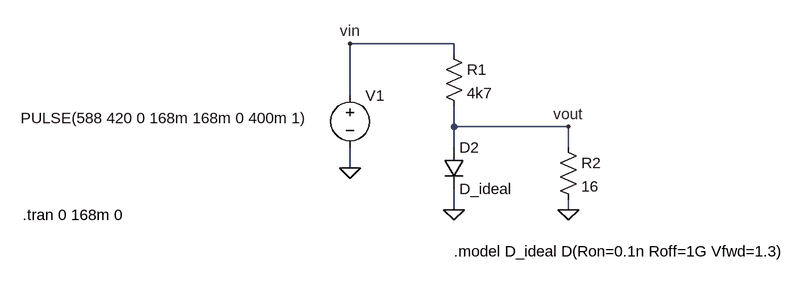
[diagram p0: schematic discharge.asc]
discharge.asc, the LTspice schematic file:
Version 4.1
SHEET 1 880 680
WIRE 96 32 -64 32
WIRE 96 48 96 32
WIRE -64 112 -64 32
WIRE 96 160 96 128
WIRE 272 160 96 160
WIRE 96 192 96 160
WIRE 272 192 272 160
WIRE -64 224 -64 192
WIRE 96 288 96 256
WIRE 272 288 272 272
FLAG -64 224 0
FLAG 272 160 vout
FLAG -64 32 vin
FLAG 96 288 0
FLAG 272 288 0
SYMBOL voltage -64 96 R0
WINDOW 3 -507 51 Left 2
WINDOW 123 0 0 Left 0
WINDOW 39 0 0 Left 0
SYMATTR Value PULSE(588 420 0 168m 168m 0 400m 1)
SYMATTR InstName V1
SYMBOL res 80 32 R0
SYMATTR InstName R1
SYMATTR Value 4k7
SYMBOL res 256 176 R0
SYMATTR InstName R2
SYMATTR Value 16
SYMBOL diode 80 192 R0
SYMATTR InstName D2
SYMATTR Value D_ideal
TEXT -568 296 Left 2 !.tran 0 168m 0
TEXT 96 352 Left 2 !.model D_ideal D(Ron=0.1n Roff=1G Vfwd=1.3)

The netlist it stands for:
* discharge.asc
V1 vin 0 PULSE(588 420 0 168m 168m 0 400m 1)
R1 vin vout 4k7
R2 vout 0 16
D2 vout 0 D_ideal
.model D D
.lib standard.dio
.tran 0 168m 0
.model D_ideal D(Ron=0.1n Roff=1G Vfwd=1.3)
.backanno
.end